# EAGLE design SHT Test Module (EAGLE 8.4.0)
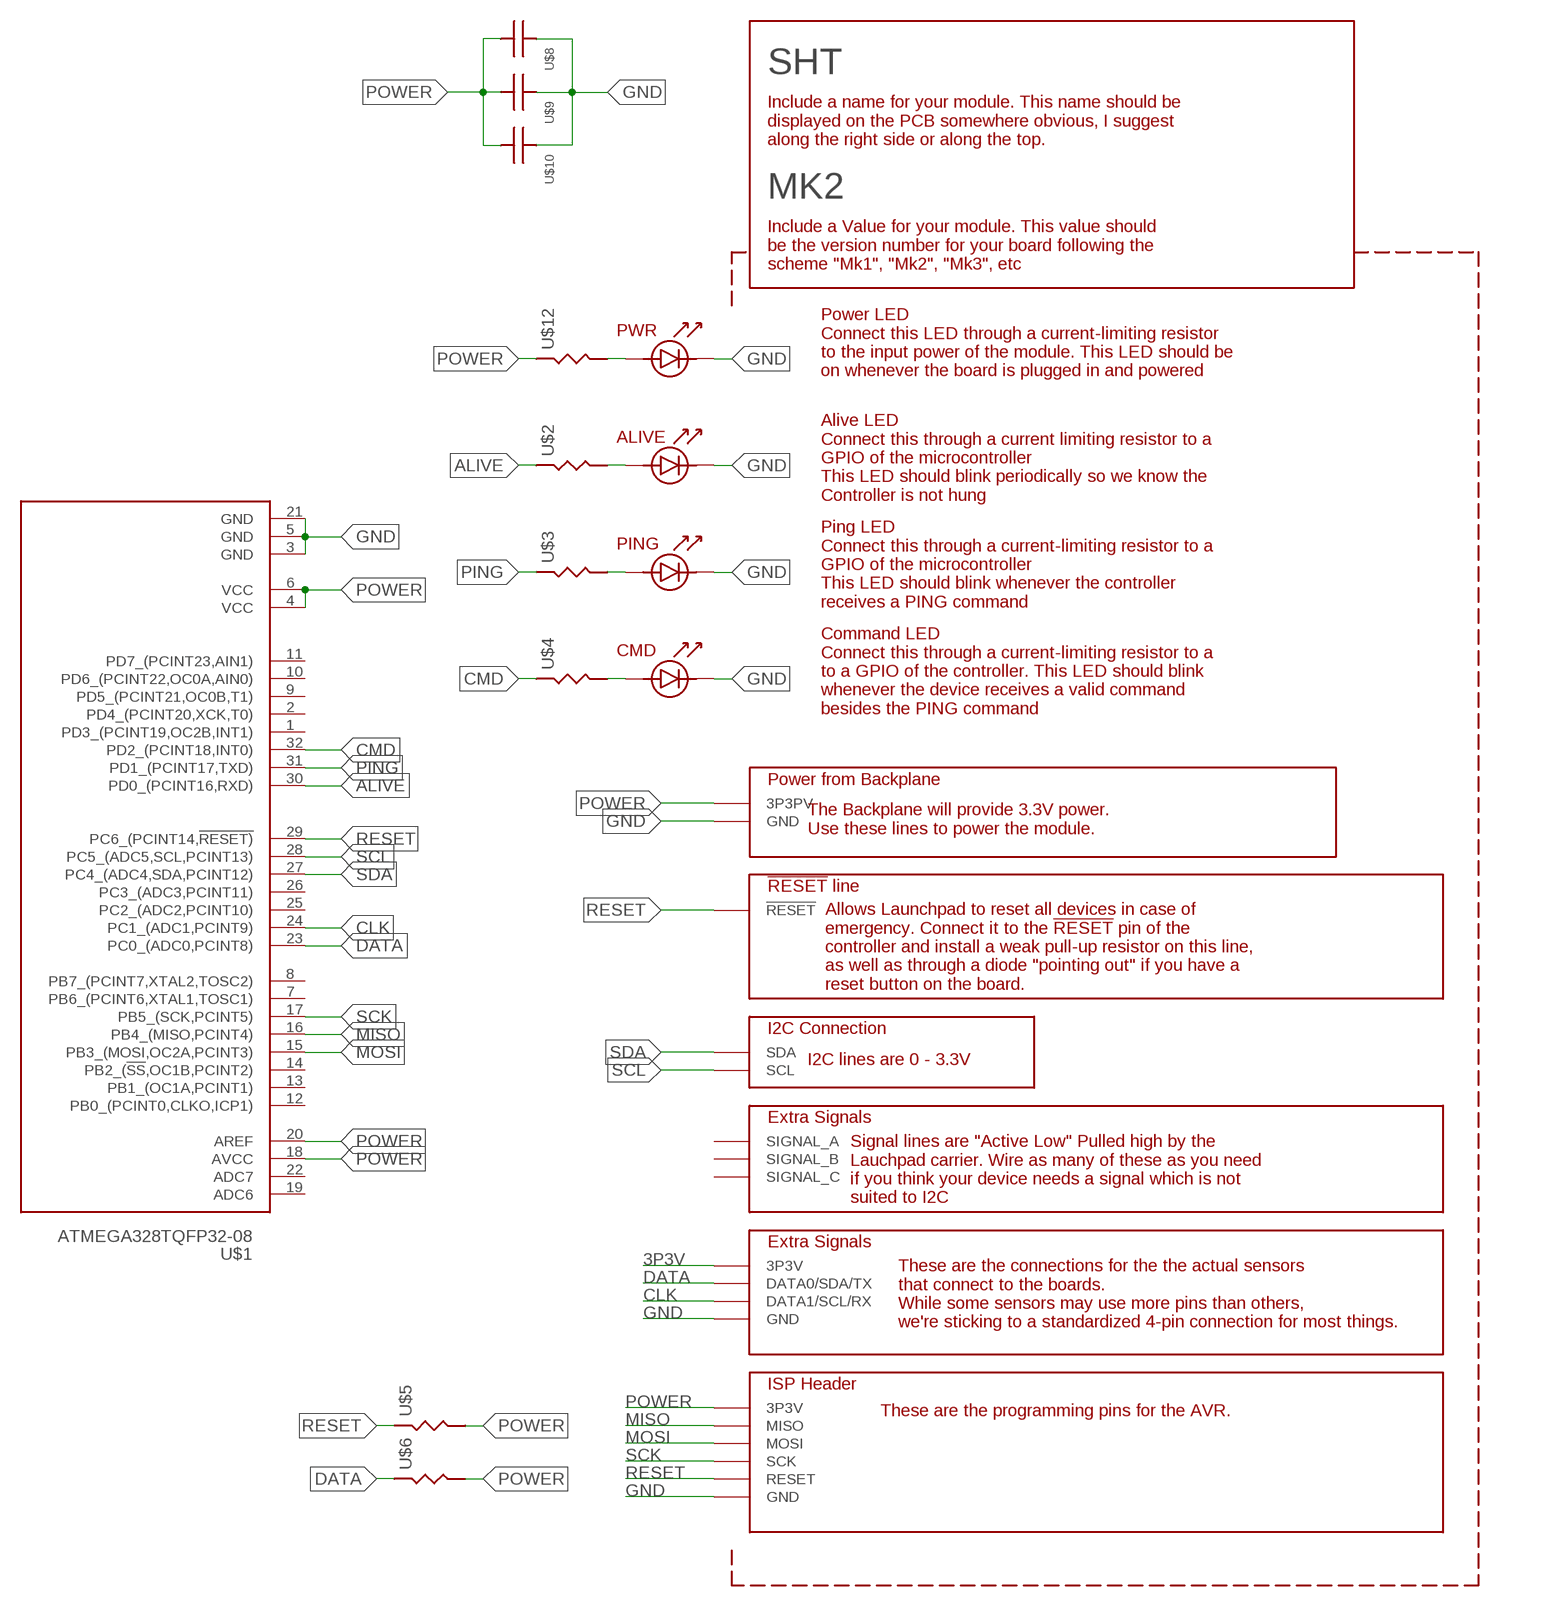
[diagram p0: schematic, sheet 1]

## Parts
SHT  MK2  SENSOR_MODULE_MK1  [SENSOR_MODULE_MK1]
U$1  ATMEGA328TQFP32-08  [TQFP32-08]
U$2  RESISTOR  [0805_STACKPOLERESISTOR]
U$3  RESISTOR  [0805_STACKPOLERESISTOR]
U$4  RESISTOR  [0805_STACKPOLERESISTOR]
U$5  RESISTOR  [0805_STACKPOLERESISTOR]
U$6  RESISTOR  [0805_STACKPOLERESISTOR]
U$8  CAPACITOR-UNPOLARIZED0805  [0805_STACKPOLERESISTOR]
U$9  CAPACITOR-UNPOLARIZED0805  [0805_STACKPOLERESISTOR]
U$10  CAPACITOR-UNPOLARIZED0805  [0805_STACKPOLERESISTOR]
U$12  RESISTOR  [0805_STACKPOLERESISTOR]

## Nets
3P3V: SHT.3P3V@2(3P3V) SHT.3P3V@3(3P3V)
ALIVE: U$1.30(PD0_(PCINT16,RXD)) U$2.P$1
CLK: SHT.DATA1@1(DATA1/SCL/RX) SHT.DATA1@2(DATA1/SCL/RX) U$1.24(PC1_(ADC1,PCINT9))
CMD: U$1.32(PD2_(PCINT18,INT0)) U$4.P$1
DATA: SHT.DATA0@1(DATA0/SDA/TX) SHT.DATA0@2(DATA0/SDA/TX) U$1.23(PC0_(ADC0,PCINT8)) U$6.P$1
GND: SHT.ALIVELED_CATHODE SHT.CMDLED_CATHODE SHT.GND@1(GND) SHT.GND@2(GND) SHT.GND@3(GND) SHT.GND@4(GND) SHT.PINGLED_CATHODE SHT.PWRLED_CATHODE U$1.3(GND) U$1.5(GND) U$1.21(GND) U$8.P$1 U$9.P$1 U$10.P$1
MISO: SHT.MISO U$1.16(PB4_(MISO,PCINT4))
MOSI: SHT.MOSI U$1.15(PB3_(MOSI,OC2A,PCINT3))
N$12: SHT.PWRLED_ANODE U$12.P$2
N$13: SHT.ALIVELED_ANODE U$2.P$2
N$14: SHT.PINGLED_ANODE U$3.P$2
N$15: SHT.CMDLED_ANODE U$4.P$2
PING: U$1.31(PD1_(PCINT17,TXD)) U$3.P$1
POWER: SHT.3P3V@1(3P3PV) SHT.3P3V@4(3P3V) U$1.4(VCC) U$1.6(VCC) U$1.18(AVCC) U$1.20(AREF) U$5.P$2 U$6.P$2 U$8.P$2 U$9.P$2 U$10.P$2 U$12.P$1
RESET: SHT.RESET@1(!RESET) SHT.RESET@2(RESET) U$1.29(PC6_(PCINT14,!RESET)) U$5.P$1
SCK: SHT.SCK U$1.17(PB5_(SCK,PCINT5))
SCL: SHT.SCL U$1.28(PC5_(ADC5,SCL,PCINT13))
SDA: SHT.SDA U$1.27(PC4_(ADC4,SDA,PCINT12))
Unconnected: SHT.A(SIGNAL_A) SHT.B(SIGNAL_B) SHT.C(SIGNAL_C) U$1.1(PD3_(PCINT19,OC2B,INT1)) U$1.2(PD4_(PCINT20,XCK,T0)) U$1.7(PB6_(PCINT6,XTAL1,TOSC1)) U$1.8(PB7_(PCINT7,XTAL2,TOSC2)) U$1.9(PD5_(PCINT21,OC0B,T1)) U$1.10(PD6_(PCINT22,OC0A,AIN0)) U$1.11(PD7_(PCINT23,AIN1)) U$1.12(PB0_(PCINT0,CLKO,ICP1)) U$1.13(PB1_(OC1A,PCINT1)) U$1.14(PB2_(!SS,OC1B,PCINT2)) U$1.19(ADC6) U$1.22(ADC7) U$1.25(PC2_(ADC2,PCINT10)) U$1.26(PC3_(ADC3,PCINT11))

## Library data of the parts
SHT = 000_CustomPartsMaster:SENSOR_MODULE_MK1
U$1 = 000_CustomPartsMaster:ATMEGA328
U$2-U$6 U$12 = 000_CustomPartsMaster:RESISTOR
U$8-U$10 = 000_CustomPartsMaster:CAPACITOR-UNPOLARIZED

## Board
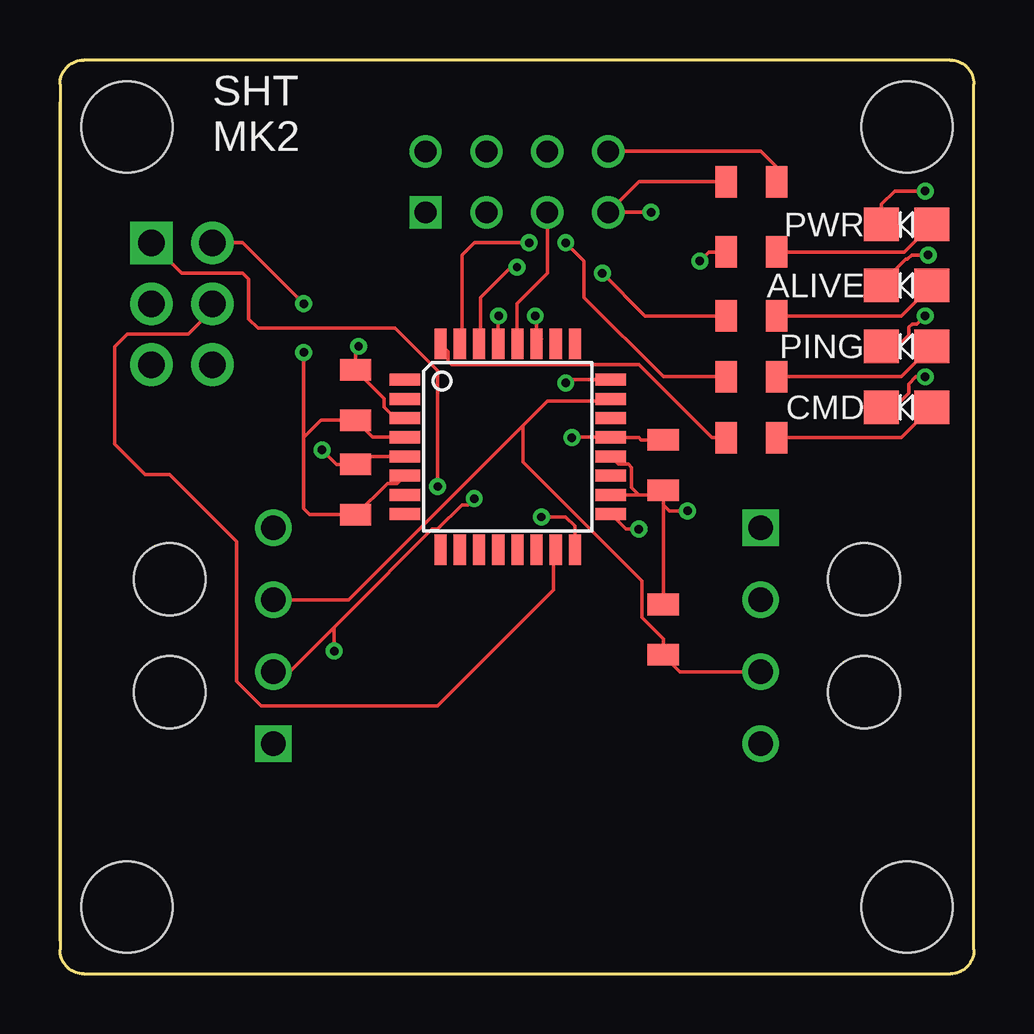
[diagram p1: board, top side]
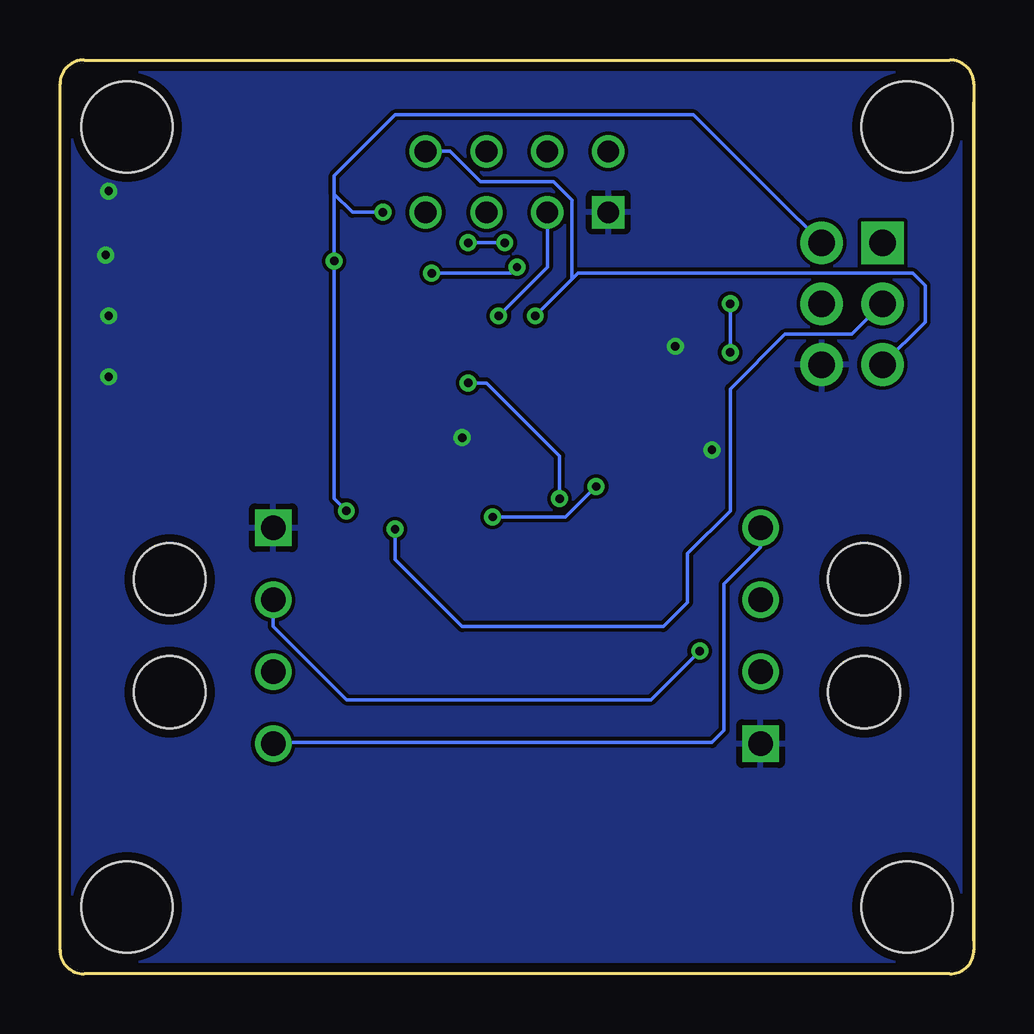
[diagram p2: board, bottom side, seen from below]

Size 38.1 x 38.1 mm. Coordinates in mm from the lower left corner, seen from the top.
Outline: 0,1.4 0,36.32
Copper layers (1*16): Top 0.0356mm / dielectric 1.5011mm / Bottom 0.0356mm
Design rules "LaenPCBOrder": minimum track width 6mil, minimum drill 13mil, track to track 6mil, track to pad 6mil, pad to pad 6mil, via to via 6mil, smd to smd 6mil, copper to edge 15mil, drill to drill 6mil, minimum pad ring 7mil, minimum via ring 7mil, stop-mask expansion 3mil, vias tented up to drill 0mil, thermal gap 10mil

### Footprints (pad centres in the part's own frame; a part is rotated, then mirrored left to right if it is on the bottom)
SENSOR_MODULE_MK1 = drill 0.9: 3P3V@1 22.86,31.75; A 20.32,34.29; B 17.78,34.29; C 15.24,34.29; RESET@1 22.86,34.29; SCL 20.32,31.75; SDA 17.78,31.75 | drill 1.02: 3P3V@2 8.892,18.597; 3P3V@3 29.208,9.597; DATA0@1 8.892,15.597; DATA0@2 29.208,12.597; DATA1@1 8.892,12.597; DATA1@2 29.208,15.597 | drill 1.1 pad 1.778: 3P3V@4 6.35,30.48; GND@4 6.35,25.4; MOSI 6.35,27.94; RESET@2 3.81,25.4; SCK 3.81,27.94 | smd 1.45 x 1.4: ALIVELED_ANODE 36.343,28.702; ALIVELED_CATHODE 34.243,28.702; CMDLED_ANODE 36.343,23.622; CMDLED_CATHODE 34.243,23.622; PINGLED_ANODE 36.343,26.162; PINGLED_CATHODE 34.243,26.162; PWRLED_ANODE 36.343,31.242; PWRLED_CATHODE 34.243,31.242 | drill 0.9 square: GND@1 15.24,31.75 | drill 1.02 square: GND@2 8.892,9.597; GND@3 29.208,18.597 | drill 1.1 pad 1.778 square: MISO 3.81,30.48 | hole 3.797: 2.794,2.794; 35.306,2.794; 2.794,35.306; 35.306,35.306 | hole 3: 4.572,11.747; 4.572,16.447; 33.528,16.447; 33.528,11.747
TQFP32-08 = smd 1.27 x 0.508: 1 -4.293,2.8; 2 -4.293,2; 3 -4.293,1.2; 4 -4.293,0.4; 5 -4.293,-0.4; 6 -4.293,-1.2; 7 -4.293,-2; 8 -4.293,-2.8; 17 4.293,-2.8; 18 4.293,-2; 19 4.293,-1.2; 20 4.293,-0.4; 21 4.293,0.4; 22 4.293,1.2; 23 4.293,2; 24 4.293,2.8 | smd 0.508 x 1.27: 9 -2.8,-4.293; 10 -2,-4.293; 11 -1.2,-4.293; 12 -0.4,-4.293; 13 0.4,-4.293; 14 1.2,-4.293; 15 2,-4.293; 16 2.8,-4.293; 25 2.8,4.293; 26 2,4.293; 27 1.2,4.293; 28 0.4,4.293; 29 -0.4,4.293; 30 -1.2,4.293; 31 -2,4.293; 32 -2.8,4.293
0805_STACKPOLERESISTOR = smd 0.9 x 1.3: P$1 -1.05,0; P$2 1.05,0

### Placement (x,y rotation side)
SHT  0,0 0 top
U$1  18.67,21.97 0 top
U$2  28.83,27.43 0 top
U$3  28.83,24.89 0 top
U$4  28.83,22.35 0 top
U$5  28.83,33.02 180 top
U$6  25.15,14.35 90 top
U$8  12.32,20.19 270 top
U$9  12.32,24.13 270 top
U$10  25.15,21.21 270 top
U$12  28.83,30.1 0 top

### Tracks (layer width: path | path; a pad name or v marks a point on that pad's centre or on a via)
3P3V
  Bottom 0.152: SHT.3P3V@2 8.89,17.78 10.41,16.26 10.41,10.16 10.92,9.65 29.15,9.65 SHT.3P3V@3
ALIVE  (via drill 0.35)
  Top 0.152: U$2.P$1 24.38,27.43 v22.61,29.21 | v19.05,29.46 18.8,29.46 17.53,28.19 17.53,26.32 U$1.30
  Bottom 0.152: v22.61,29.21 19.3,29.21 v19.05,29.46
CLK  (via drill 0.35)
  Top 0.152: SHT.DATA1@1 9.57,12.6 11.95,14.97 | 11.95,14.97 15.52,18.54 15.75,18.54 16.76,19.56 17.02,19.56 v17.27,19.81 | U$1.24 21.21,24.77 v21.08,24.64 | v11.43,13.46 11.43,14.45 11.95,14.97
  Bottom 0.152: v17.27,19.81 17.27,21.59 20.32,24.64 v21.08,24.64 | SHT.DATA1@2 29.21,14.48 26.16,11.43 13.46,11.43 v11.43,13.46
CMD
  Top 0.152: U$4.P$1 27.18,22.35 24.13,25.4 16.32,25.4 16.19,25.53 16.19,25.95 U$1.32
DATA
  Top 0.152: SHT.DATA0@2 25.85,12.6 U$6.P$1 25.15,13.97 24.38,14.73 24.38,14.74 24.27,14.86 24.27,16.37 19.3,21.34 19.3,22.86 19.43,22.99 | SHT.DATA0@1 12.04,15.6 19.43,22.99 | U$1.23 22.87,23.88 20.32,23.88 19.43,22.99
GND  (via drill 0.35)
  Top 0.152: SHT.CMDLED_CATHODE 34.8,23.62 35.39,24.21 35.39,24.59 35.69,24.89 v36.07,24.89 | SHT.PINGLED_CATHODE 34.92,26.16 35.39,26.63 35.39,26.96 35.52,27.09 35.73,27.09 v36.07,27.43 | SHT.ALIVELED_CATHODE 34.24,28.78 35.26,29.79 35.33,29.79 35.5,29.97 v36.2,29.97 | SHT.PWRLED_CATHODE 34.24,32.08 34.8,32.64 v36.07,32.64 | 12.03,25.18 U$9.P$1 | U$1.5 12.65,21.57 U$8.P$1 11.52,21.24 v10.92,21.84 | U$9.P$1 13.51,23.99 13.51,23.62 13.96,23.17 U$1.3 | U$10.P$1 24.22,22.26 24.13,22.35 22.98,22.35 U$1.21 21.36,22.37 v21.34,22.35 | U$9.P$1 12.32,26.04 v12.45,26.16
  pour Bottom: 0,36.32 0,37.08 arc-90 1.02,38.1 1.78,38.1 37.08,38.1 arc-90 38.1,37.08 38.1,36.83 38.1,1.02 arc-90 37.08,0 36.32,0 1.02,0 arc-90 0,1.02 0,1.52
MISO  (via drill 0.35)
  Top 0.152: U$1.16 21.47,18.66 21.08,19.05 v20.07,19.05 | v15.75,20.32 15.75,25.15 13.97,26.92 8.26,26.92 7.87,27.3 7.87,28.96 7.62,29.21 5.08,29.21 SHT.MISO
  Bottom 0.152: v15.75,20.32 17.02,19.05 v20.07,19.05
MOSI
  Top 0.152: U$1.15 20.57,17.58 20.57,16 15.75,11.18 8.38,11.18 7.37,12.19 7.37,18.03 4.57,20.83 3.56,20.83 2.29,22.1 2.29,26.16 2.79,26.67 5.33,26.67 6.35,27.69 SHT.MOSI
N$12
  Top 0.152: U$12.P$2 35.2,30.1 SHT.PWRLED_ANODE
N$13
  Top 0.152: U$2.P$2 35.07,27.43 SHT.ALIVELED_ANODE
N$14
  Top 0.152: U$3.P$2 35.07,24.89 SHT.PINGLED_ANODE
N$15
  Top 0.152: U$4.P$2 35.07,22.35 SHT.CMDLED_ANODE
PING  (via drill 0.35)
  Top 0.152: U$3.P$1 25.15,24.89 21.84,28.19 21.84,29.72 v21.08,30.48 | v19.56,30.48 17.27,30.48 16.76,29.97 16.76,26.36 U$1.31
  Bottom 0.152: v21.08,30.48 v19.56,30.48
POWER  (via drill 0.35)
  Top 0.152: U$1.6 14.06,20.45 13.65,20.45 12.34,19.14 U$8.P$2 10.41,19.14 10.16,19.4 10.16,22.35 | U$1.4 13.03,22.37 U$9.P$2 10.89,23.08 10.16,22.35 | 24.13,19.97 U$1.18 | 24.13,19.97 24.96,19.97 25.1,20.11 | 25.1,20.11 U$10.P$2 | U$1.20 23.28,21.25 23.69,21.25 23.82,21.12 23.82,20.28 24.13,19.97 | 25.15,19.56 U$6.P$2 | 25.15,19.56 25.15,20.07 25.1,20.11 | v26.16,19.3 25.4,19.3 25.15,19.56 | U$12.P$1 27.05,30.1 v26.67,29.72 | U$5.P$2 24.13,33.02 SHT.3P3V@1 v24.64,31.75 | 10.16,22.35 v10.16,25.91 | v10.16,27.94 7.62,30.48 SHT.3P3V@4
  Bottom 0.152: v26.16,19.3 26.67,19.81 v26.67,29.72 26.67,32.51 | 8.26,32.38 8.13,32.26 | 8.26,32.38 11.68,35.81 24.13,35.81 26.67,33.27 26.67,32.51 | v24.64,31.75 25.91,31.75 26.67,32.51 | SHT.3P3V@4 8.26,32.38 | v10.16,25.91 v10.16,27.94
RESET  (via drill 0.35)
  Top 0.152: U$5.P$1 29.88,33.62 29.21,34.29 SHT.RESET@1 | U$1.29 18.27,27.41 v18.29,27.43
  Bottom 0.152: SHT.RESET@1 21.84,34.29 20.57,33.02 17.53,33.02 16.76,32.26 16.76,28.96 | 16.76,28.96 v18.29,27.43 | 16.76,28.96 16.51,29.21 2.54,29.21 2.03,28.7 2.03,27.18 SHT.RESET@2
SCK  (via drill 0.35)
  Top 0.152: v24.13,18.54 23.59,18.54 U$1.17
  Bottom 0.152: v24.13,18.54 24.13,17.27 21.34,14.48 12.95,14.48 11.94,15.49 11.94,17.53 10.16,19.3 10.16,24.38 7.87,26.67 5.08,26.67 SHT.SCK
SCL
  Top 0.152: SHT.SCL 20.32,29.21 19.05,27.94 19.05,26.28 U$1.28
SDA  (via drill 0.35)
  Top 0.152: 20.07,26.46 U$1.27 19.87,27.38 v19.81,27.43
  Bottom 0.152: SHT.SDA 17.78,29.46 v19.81,27.43